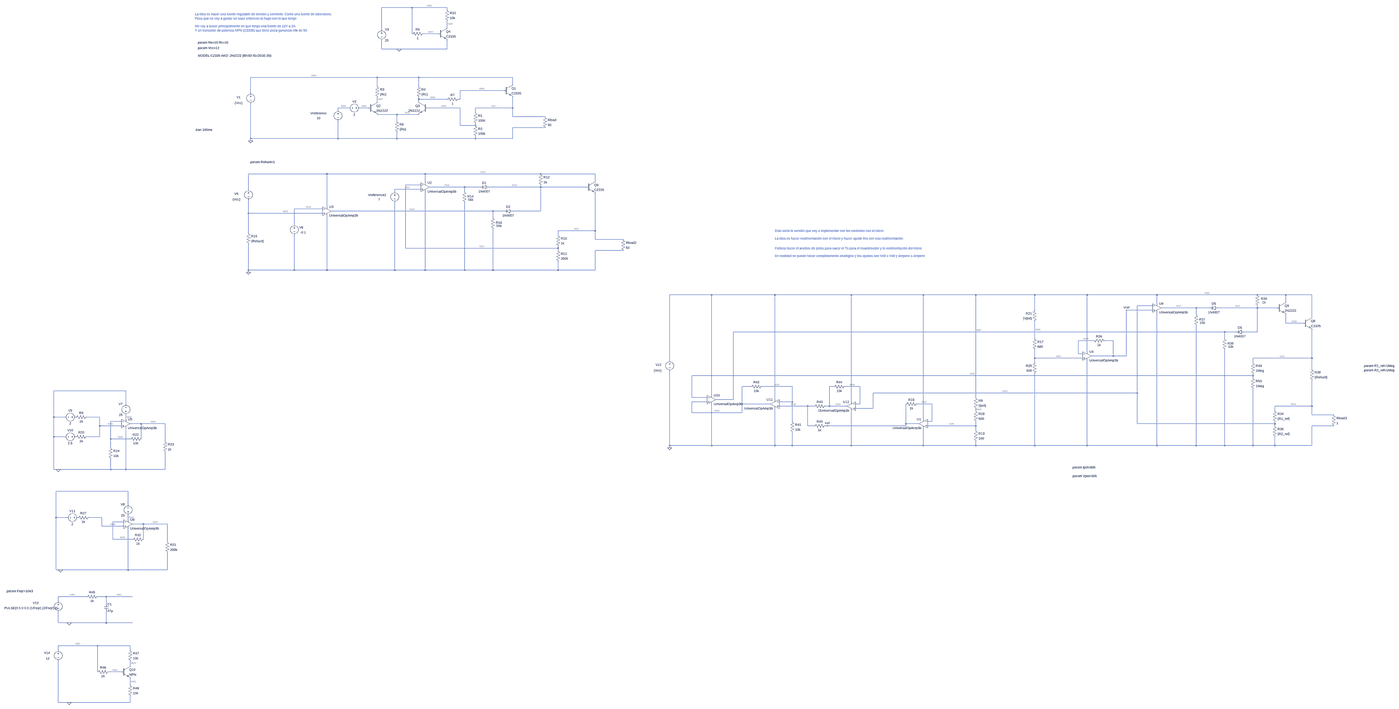
[diagram p0: schematic voltage_regulator.asc, whole sheet]
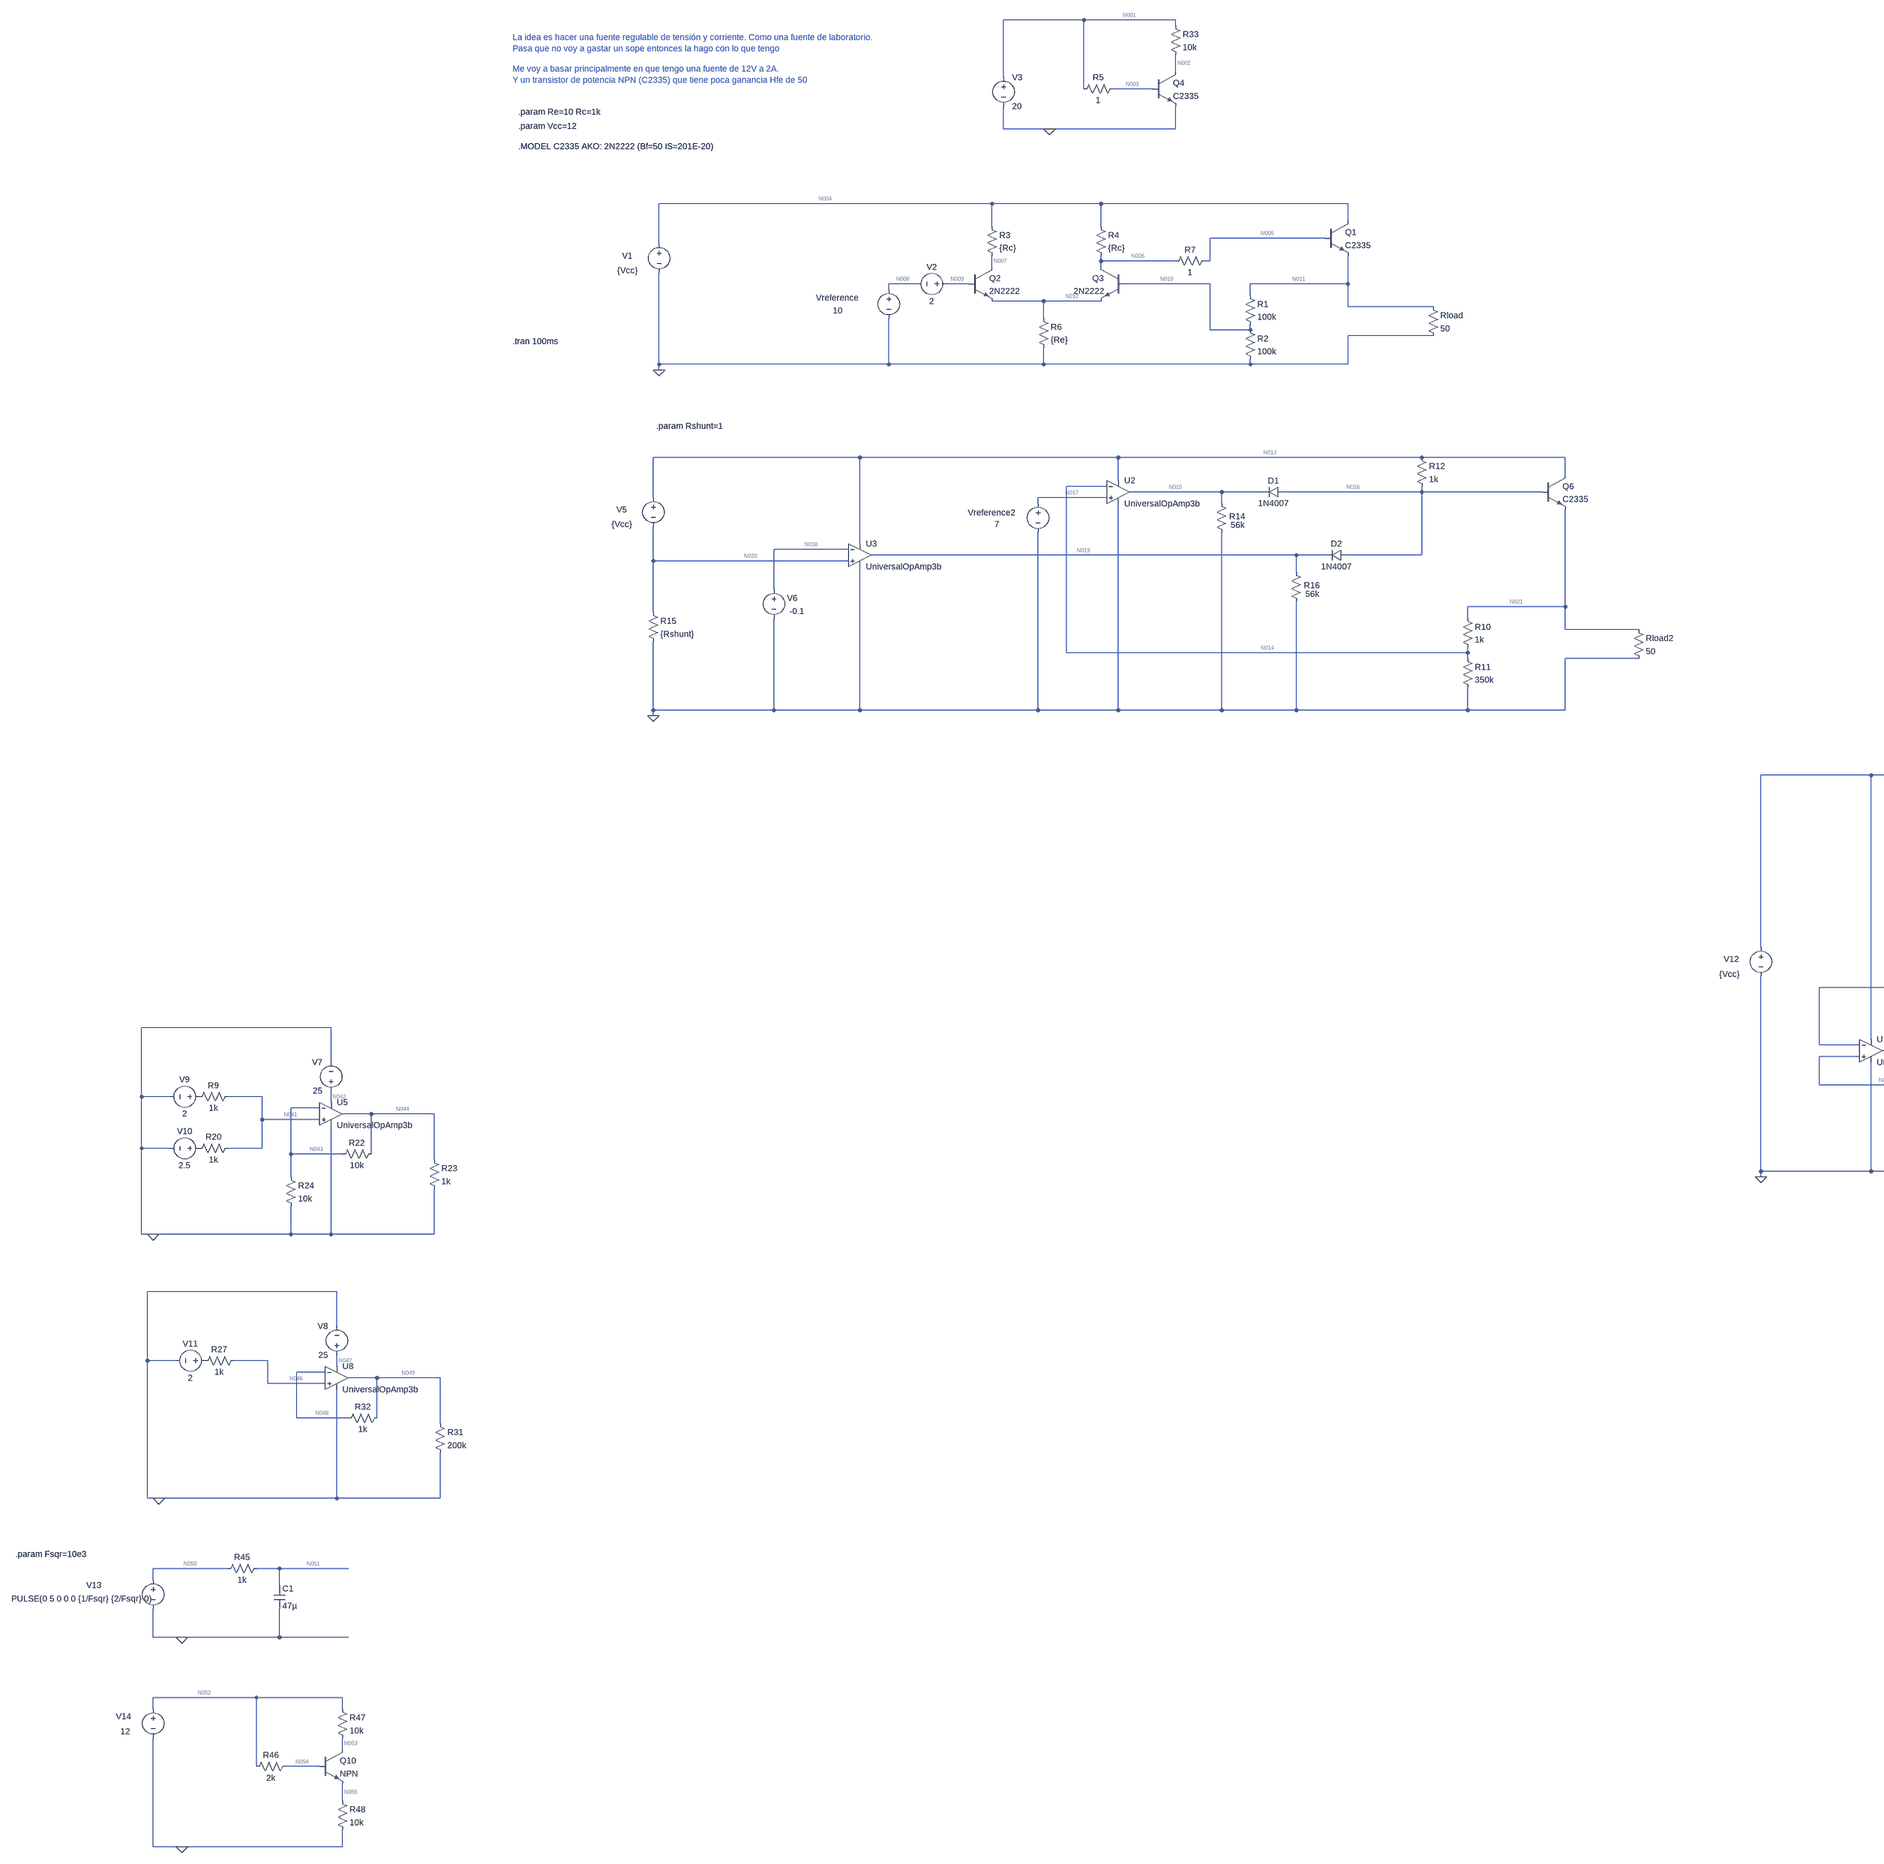
[diagram p1: schematic voltage_regulator.asc, part, row 1 of 1, column 1 of 2]
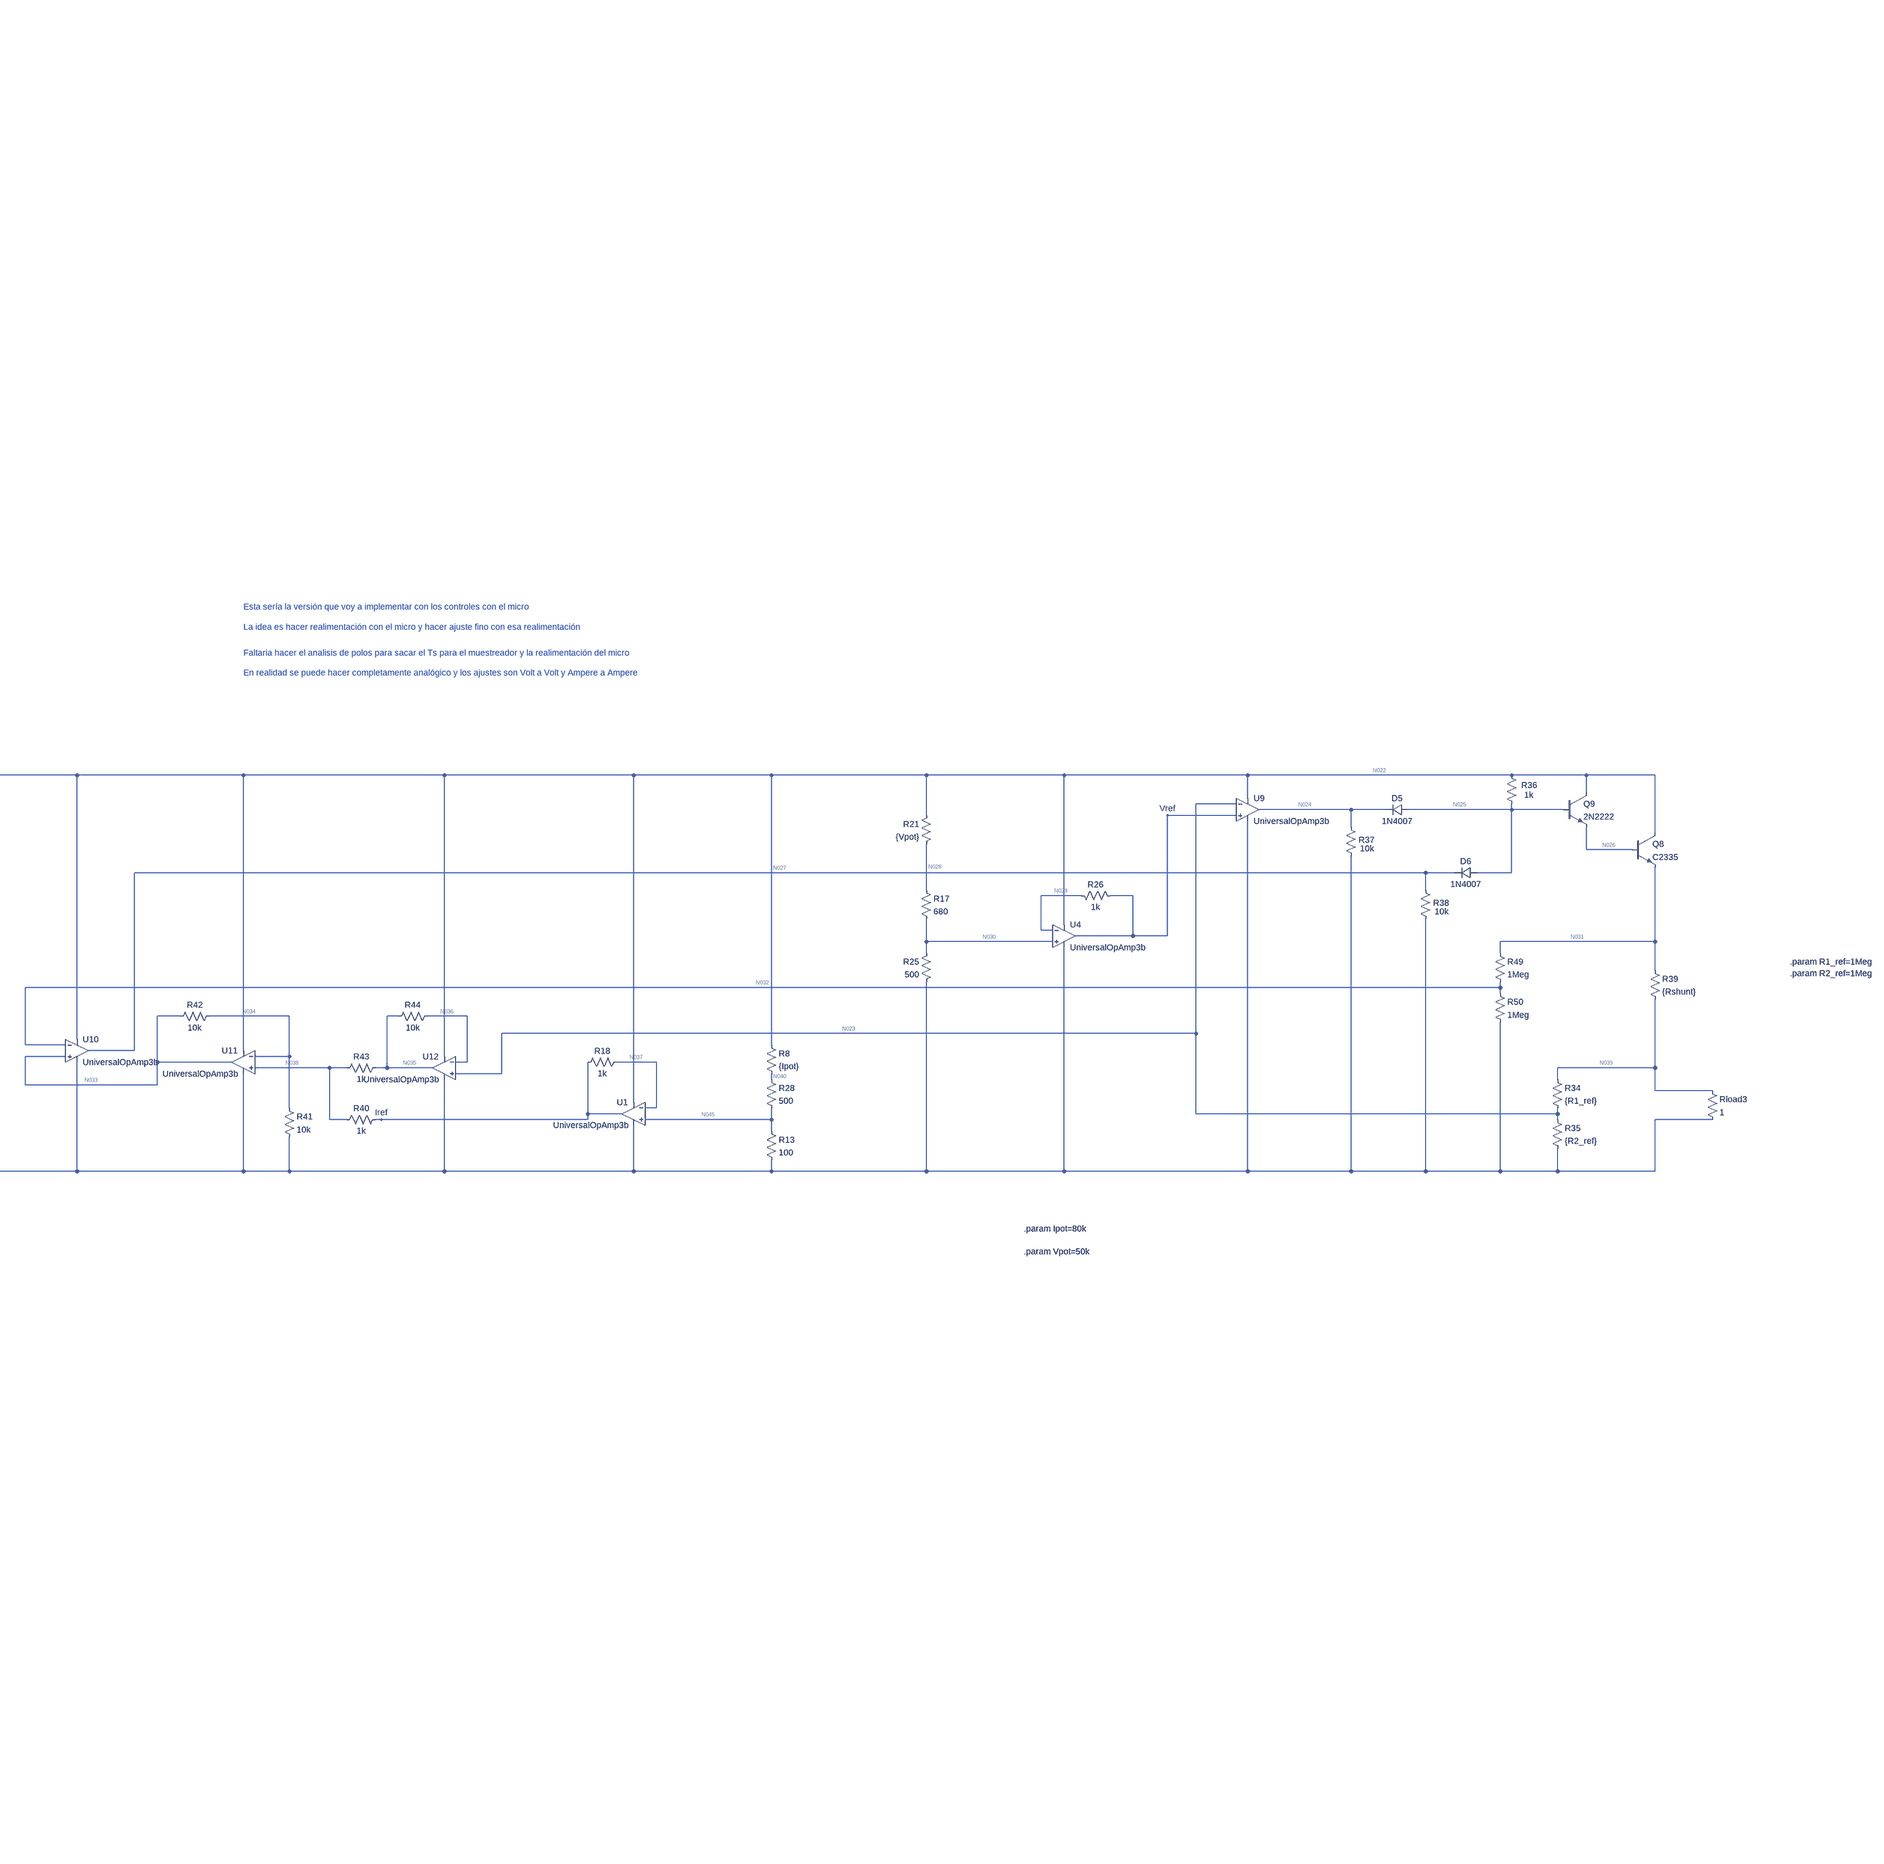
[diagram p2: schematic voltage_regulator.asc, part, row 1 of 1, column 2 of 2]
* voltage_regulator.asc
Q1 N004 N005 N011 0 C2335
V1 N004 0 {Vcc}
Vreference N008 0 10
Rload N011 0 50
R1 N011 N010 100k
R2 N010 0 100k
R3 N004 N007 {Rc}
Q2 N007 N009 N012 0 2N2222
Q3 N006 N010 N012 0 2N2222
R4 N004 N006 {Rc}
V2 N009 N008 2
V3 N001 0 20
R5 N003 N001 1
R6 N012 0 {Re}
R7 N005 N006 1
Q6 N013 N016 N021 0 C2335
V5 N013 N020 {Vcc}
Rload2 N021 0 50
R10 N021 N014 1k
R11 N014 0 350k
* U2: UniversalOpAmp3b (symbol OpAmps\UniversalOpAmp3b not available, pins judged from their places): In+=N017 In-=N014 V+=N013 V-=0 OUT=N015
Vreference2 N017 0 7
D1 N016 N015 1N4007
R12 N013 N016 1k
R14 N015 0 56k
R15 N020 0 {Rshunt}
* U3: UniversalOpAmp3b (symbol OpAmps\UniversalOpAmp3b not available, pins judged from their places): In+=N020 In-=N018 V+=N013 V-=0 OUT=N019
D2 N016 N019 1N4007
R16 N019 0 56k
Q4 N002 N003 0 0 C2335
V6 N018 0 -0.1
* U5: UniversalOpAmp3b (symbol OpAmps\UniversalOpAmp3b not available, pins judged from their places): In+=N041 In-=N043 V+=N042 V-=0 OUT=N044
R9 N041 P001 1k
R20 N041 P002 1k
V7 N042 0 25
V9 P001 0 2
V10 P002 0 2.5
R23 N044 0 1k
R22 N044 N043 10k
R24 N043 0 10k
* U8: UniversalOpAmp3b (symbol OpAmps\UniversalOpAmp3b not available, pins judged from their places): In+=N046 In-=N048 V+=N047 V-=0 OUT=N049
R27 N046 P003 1k
V8 N047 0 25
V11 P003 0 2
R31 N049 0 200k
R32 N049 N048 1k
R33 N001 N002 10k
Q8 N022 N026 N031 0 C2335
V12 N022 0 {Vcc}
Rload3 N039 0 1
R34 N039 N023 {R1_ref}
R35 N023 0 {R2_ref}
* U9: UniversalOpAmp3b (symbol OpAmps\UniversalOpAmp3b not available, pins judged from their places): In+=Vref In-=N023 V+=N022 V-=0 OUT=N024
D5 N025 N024 1N4007
R36 N022 N025 1k
R37 N024 0 10k
* U10: UniversalOpAmp3b (symbol OpAmps\UniversalOpAmp3b not available, pins judged from their places): In+=N033 In-=N032 V+=N022 V-=0 OUT=N027
D6 N025 N027 1N4007
R38 N027 0 10k
R39 N031 N039 {Rshunt}
R40 N038 Iref 1k
* U11: UniversalOpAmp3b (symbol OpAmps\UniversalOpAmp3b not available, pins judged from their places): In+=N038 In-=N034 V+=N022 V-=0 OUT=N033
R41 N034 0 10k
R42 N034 N033 10k
R43 N035 N038 1k
* U12: UniversalOpAmp3b (symbol OpAmps\UniversalOpAmp3b not available, pins judged from their places): In+=N023 In-=N036 V+=N022 V-=0 OUT=N035
R44 N036 N035 10k
Q9 N022 N025 N026 0 2N2222
V13 N050 0 PULSE(0 5 0 0 0 {1/Fsqr} {2/Fsqr} 0)
R45 N051 N050 1k
C1 N051 0 47µ
V14 N052 0 12
R46 N054 N052 2k
Q10 N053 N054 N055 0 NPN
R47 N052 N053 10k
R48 N055 0 10k
R49 N031 N032 1Meg
R50 N032 0 1Meg
R8 N022 N040 {Ipot}
R13 N045 0 100
* U1: UniversalOpAmp3b (symbol OpAmps\UniversalOpAmp3b not available, pins judged from their places): In+=N045 In-=N037 V+=N022 V-=0 OUT=Iref
R18 N037 Iref 1k
R21 N022 N028 {Vpot}
R25 N030 0 500
* U4: UniversalOpAmp3b (symbol OpAmps\UniversalOpAmp3b not available, pins judged from their places): In+=N030 In-=N029 V+=N022 V-=0 OUT=Vref
R26 N029 Vref 1k
R28 N040 N045 500
R17 N028 N030 680
.model D D
.lib standard.dio
.model NPN NPN
.model PNP PNP
.lib standard.bjt
* La idea es hacer una fuente regulable de tensión y corriente. Como una fuente de laboratorio.
* Pasa que no voy a gastar un sope entonces la hago con lo que tengo
* Me voy a basar principalmente en que tengo una fuente de 12V a 2A.
* Y un transistor de potencia NPN (C2335) que tiene poca ganancia Hfe de 50
.param Vcc=12
.MODEL C2335 AKO: 2N2222 (Bf=50 IS=201E-20)
.tran 100ms
.param Re=10 Rc=1k
.param Rshunt=1
* Esta sería la versión que voy a implementar con los controles con el micro
* La idea es hacer realimentación con el micro y hacer ajuste fino con esa realimentación
* Faltaria hacer el analisis de polos para sacar el Ts para el muestreador y la realimentación del micro
* En realidad se puede hacer completamente analógico y los ajustes son Volt a Volt y Ampere a Ampere
.param Fsqr=10e3
.param R2_ref=1Meg
.param R1_ref=1Meg
.param Ipot=80k
.param Vpot=50k
.backanno
.end

* Results of the author's LTspice run, read from the files saved beside the schematic
* Operating Point, zero values left out:
*   V(n010) = 3.543 V
*   V(n016) = 5.835 V
*   V(n015) = 11.9 V
*   V(p001) = 2 V
*   V(n026) = 1.074 V
*   V(n024) = 11.99 V
*   V(n035) = 33.09 mV
*   V(n029) = 117.2 mV
*   V(n054) = 10.51 V
*   V(n005) = 8.164 V
*   V(n001) = 20 V
*   V(n043) = 2.25 V
*   V(n049) = 2 V
*   V(n039) = 42.53 mV
*   V(n038) = 24.29 mV
*   V(n037) = 15.5 mV
*   V(n009) = 12 V
*   V(n020) = -100 mV
*   V(n019) = 5.199 V
*   V(n046) = 2 V
*   V(n033) = 48.48 mV
*   V(n055) = 9.72 V
*   V(n008) = 10 V
*   V(n013) = 11.9 V
*   V(n044) = 4.5 V
*   V(n022) = 12 V
*   V(vref) = 117.2 mV
*   V(n034) = 24.3 mV
*   V(n030) = 117.2 mV
*   V(n047) = 25 V
*   V(n004) = 12 V
*   V(n006) = 8.167 V
*   V(n017) = 7 V
*   V(n041) = 2.25 V
*   V(n027) = 1.05 V
*   V(n052) = 12 V
*   V(n045) = 14.89 mV
*   V(n007) = 5.677 V
*   V(n021) = 4.795 V
*   V(n018) = -100 mV
*   V(p002) = 2.5 V
*   V(n031) = 85.06 mV
*   V(n025) = 1.723 V
*   V(n036) = 33.2 mV
*   V(n011) = 7.086 V
*   V(n003) = 18.31 V
*   V(n042) = 25 V
*   V(p003) = 2 V
*   V(n023) = 33.2 mV
*   V(iref) = 15.49 mV
*   V(n053) = 9.742 V
*   V(n028) = 276.7 mV
*   V(n048) = 2 V
*   V(n012) = 5.542 V
*   V(n014) = 4.781 V
*   V(n002) = 370.8 mV
*   V(n032) = 48.48 mV
*   V(n040) = 89.33 mV
*   I(R2) = 35.43 µA
*   I(R15) = -100 mA
*   I(V10) = -250 µA
*   I(R6) = 554.2 mA
*   I(R39) = 42.53 mA
*   Ic(Q1) = 137.9 mA
*   Ib(Q1) = 3.833 mA
*   Ie(Q1) = -141.7 mA
*   I(R10) = 13.66 µA
*   I(R21) = 234.5 µA
*   I(R28) = 148.9 µA
*   Ic(Q4) = 1.963 mA
*   Ib(Q4) = 1.685 A
*   Ie(Q4) = -1.687 A
*   I(R42) = -2.418 µA
*   I(V12) = -54.7 mA
*   Ic(Q9) = 841.9 µA
*   Ib(Q9) = 3.827 µA
*   Ie(Q9) = -845.8 µA
*   I(Vreference) = -547.9 mA
*   I(R20) = -250 µA
*   I(R48) = 972 µA
*   I(V2) = -547.9 mA
*   I(D1) = -96.08 pA
*   I(R32) = -21 nA
*   Ic(Q6) = 93.63 mA
*   Ib(Q6) = 2.285 mA
*   Ie(Q6) = -95.92 mA
*   I(R46) = -746.2 µA
*   Ic(Q2) = 6.323 mA
*   Ib(Q2) = 547.9 mA
*   Ie(Q2) = -554.2 mA
*   I(R50) = 48.48 nA
*   I(R22) = 225 µA
*   I(R34) = 9.332 nA
*   I(R36) = 10.28 mA
*   I(V8) = -683.4 µA
*   I(R5) = -1.685 A
*   I(R38) = 105 µA
*   I(R18) = 11.97 nA
*   I(R14) = 212.5 µA
*   I(R41) = 2.43 µA
*   Ic(Q8) = 41.68 mA
*   Ib(Q8) = 845.8 µA
*   Ie(Q8) = -42.53 mA
*   I(R1) = 35.43 µA
*   I(R16) = 92.84 µA
*   I(V9) = 250 µA
*   I(R26) = 11.77 nA
*   I(Rload2) = 95.9 mA
*   I(Vreference2) = -2.1 nA
*   I(R9) = 250 µA
*   I(V1) = -148.1 mA
*   I(R4) = 3.833 mA
*   I(R44) = 11.93 nA
*   I(R47) = 225.8 µA
*   I(R13) = 148.9 µA
*   I(R31) = 10 µA
*   I(R23) = 4.5 mA
*   I(Rload3) = 42.53 mA
*   I(R49) = 36.58 nA
*   I(R3) = 6.323 mA
*   I(R7) = -3.833 mA
*   I(R27) = 21 nA
*   I(R11) = 13.66 µA
*   I(R40) = 8.805 µA
*   I(R25) = 234.5 µA
*   I(R17) = 234.5 µA
*   I(V6) = 12.1 nA
*   I(D5) = -100.3 pA
*   I(R43) = 8.793 µA
*   I(V14) = -972 µA
*   I(R12) = 6.065 mA
*   I(Rload) = 141.7 mA
*   I(V7) = -4.913 mA
*   I(D6) = 10.27 mA
*   I(V3) = -1.687 A
*   I(R33) = 1.963 mA
*   I(R37) = 1.199 mA
*   I(V5) = -100 mA
*   I(R24) = 225 µA
*   I(V11) = 21 nA
*   Ic(Q10) = 225.8 µA
*   Ib(Q10) = 746.2 µA
*   Ie(Q10) = -972 µA
*   I(R8) = 148.9 µA
*   Ic(Q3) = 4.624 pA
*   Ib(Q3) = -6.627 pA
*   Ie(Q3) = 1.998 pA
*   I(D2) = 3.78 mA
*   I(R35) = 33.2 nA
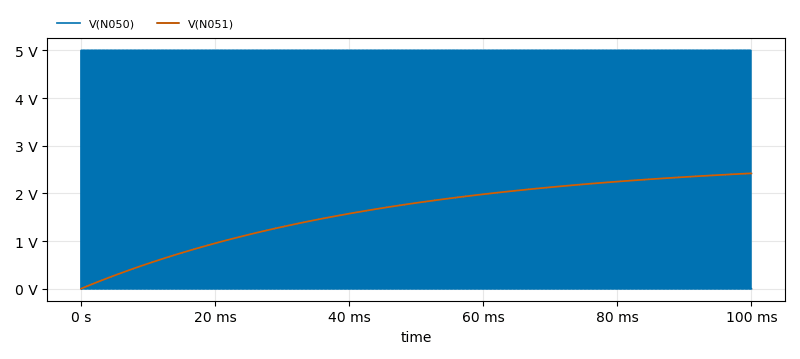
[diagram p3: Transient Analysis of voltage_regulator.asc, plotted from the saved traces]
* Transient Analysis, 1 run:
*   V(N050): min 0 V, max 5 V, average 2.75 V, rms 3.706 V, last 0 V
*   V(N051): min 0 V, max 2.424 V, average 1.612 V, rms 1.747 V, last 2.419 V